# EAGLE design controller (EAGLE 8.7.1)

## Sheet 1 of 4
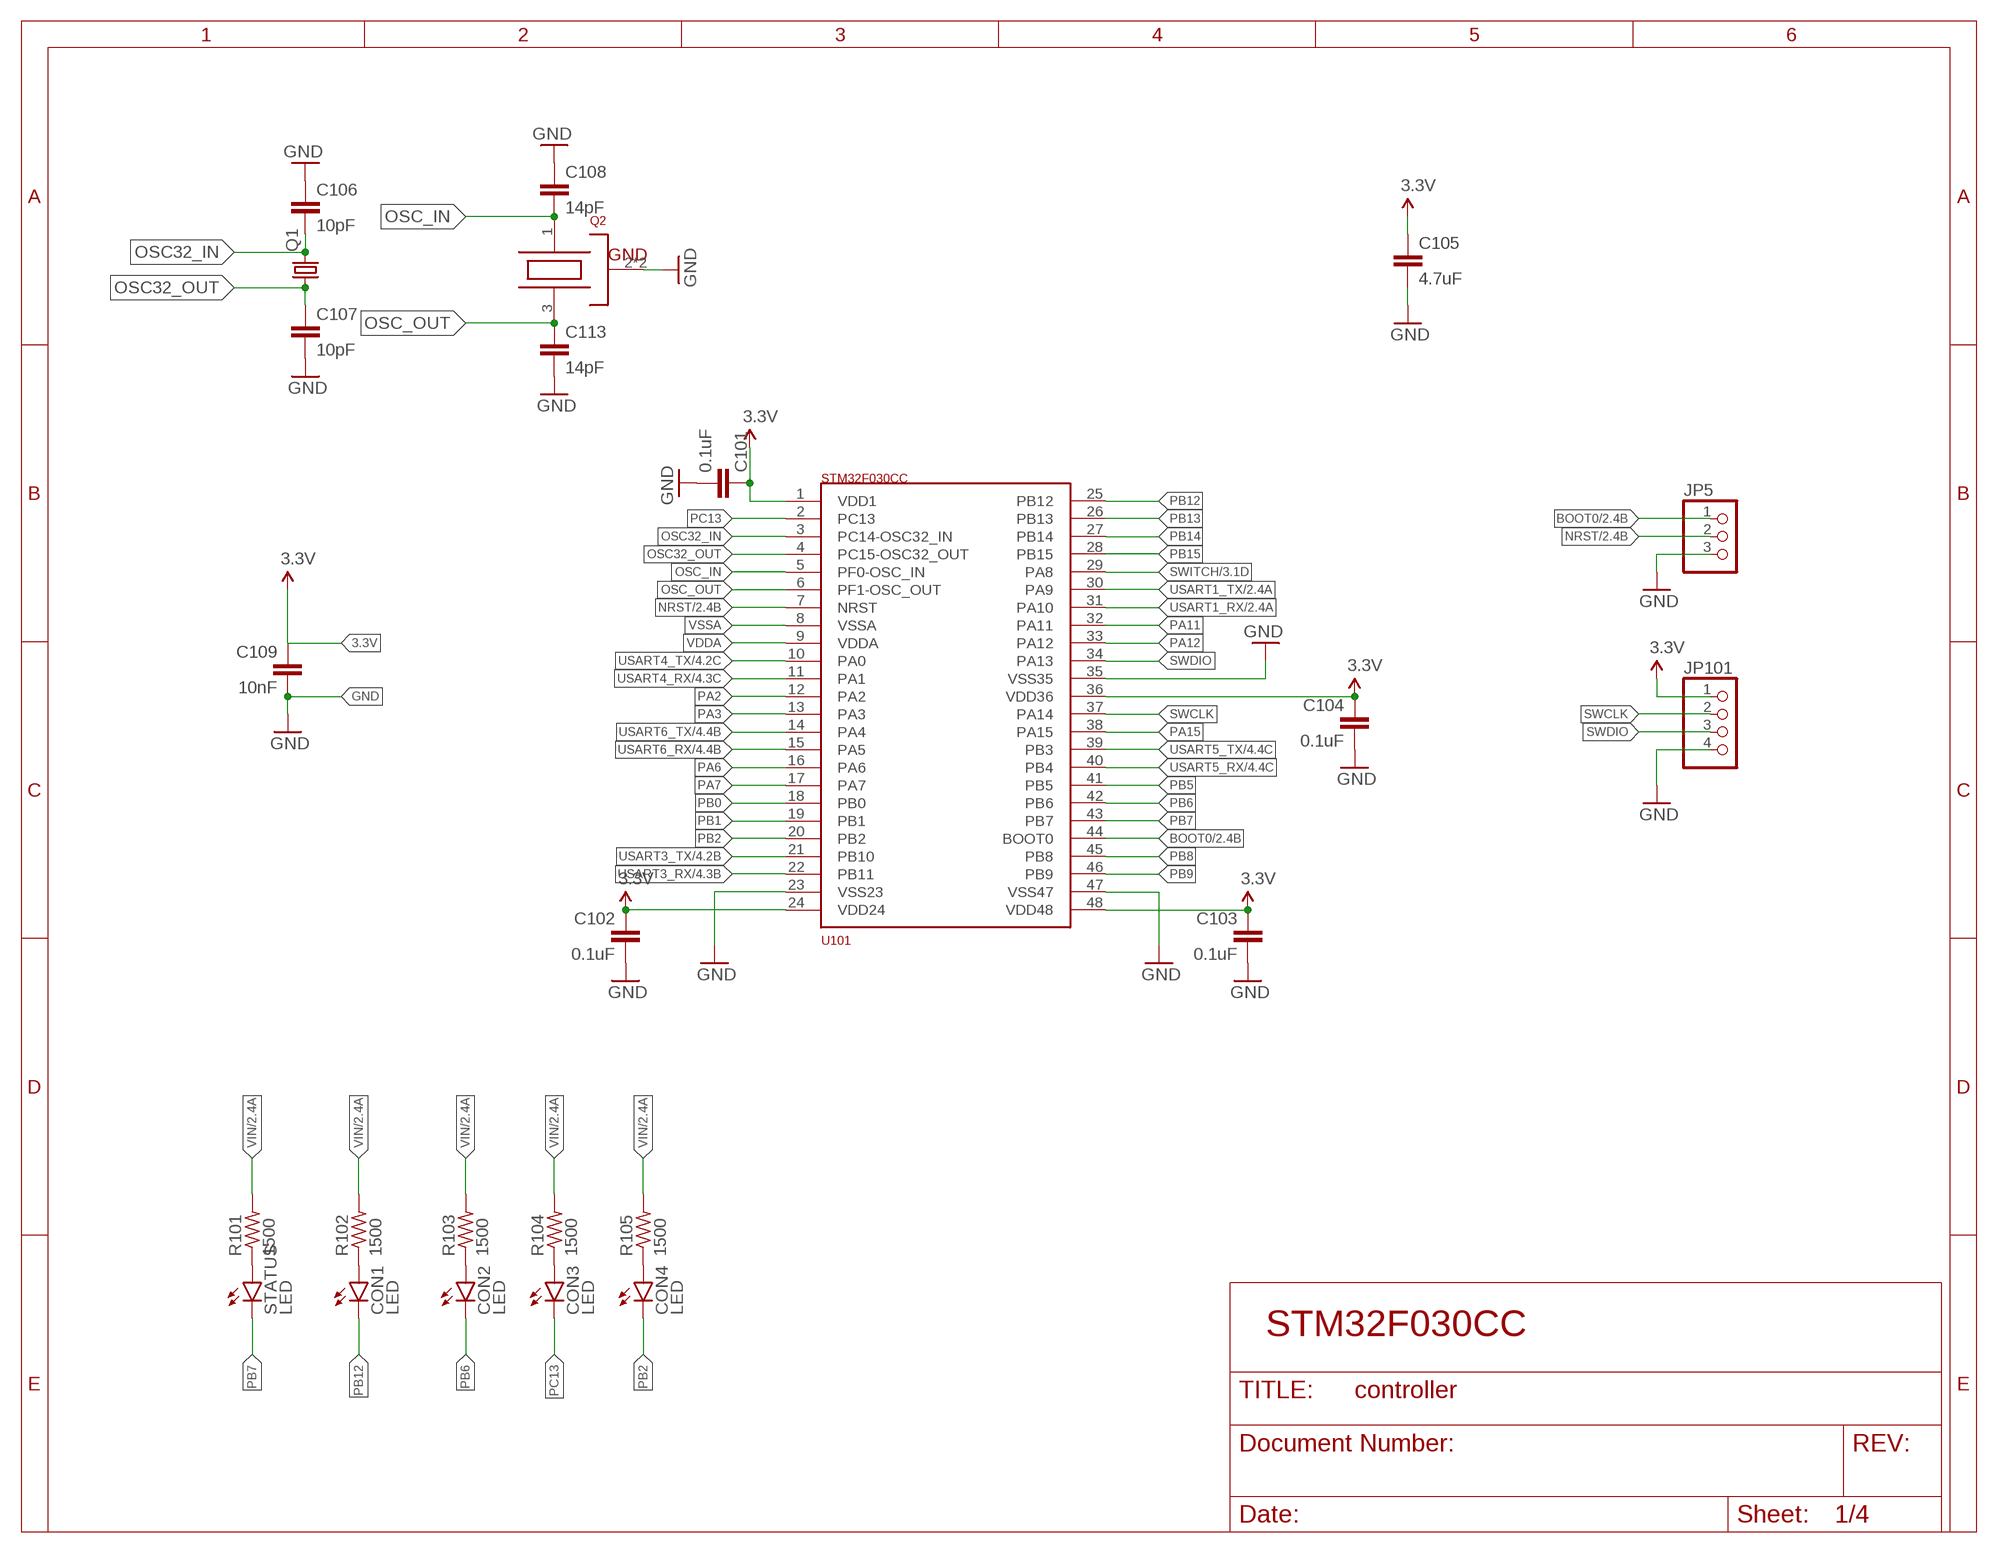
[diagram p0: schematic, sheet 1]

### Parts
C101  0.1uF  C0603  [0603-CAP]
C102  0.1uF  C0603  [0603-CAP]
C103  0.1uF  C0603  [0603-CAP]
C104  0.1uF  C0603  [0603-CAP]
C105  4.7uF  C0603  [0603-CAP]
C106  10pF  C0603  [0603-CAP]
C107  10pF  C0603  [0603-CAP]
C108  14pF  C0603  [0603-CAP]
C109  10nF  C0603  [0603-CAP]
C113  14pF  C0603  [0603-CAP]
CON1  LED  [LED-0603]
CON2  LED  [LED-0603]
CON3  LED  [LED-0603]
CON4  LED  [LED-0603]
JP5  PINHD-1X3  [1X03]
JP101  PINHD-1X4  [1X04]
Q1  CRYSTALFC1610AN  [FC1610AN]
Q2  OSCILLATOR  [OSC3.2X2.5]
R101  1500  R0603R0603  [R0603]
R102  1500  R0603R0603  [R0603]
R103  1500  R0603R0603  [R0603]
R104  1500  R0603R0603  [R0603]
R105  1500  R0603R0603  [R0603]
STATUS  LED  [LED-0603]
U101  STM32F030CC  [STM32F030CC]

### Nets
3.3V: C101.1 C102.1 C103.1 C104.1 C105.1 C109.1 JP101.1 U101.1(VDD1) U101.24(VDD24) U101.36(VDD36) U101.48(VDD48) ; also sheet 2,3
BOOT0: JP5.1 U101.44(BOOT0) ; also sheet 2
GND: C101.2 C102.2 C103.2 C104.2 C105.2 C106.1 C107.2 C108.1 C109.2 C113.2 JP5.3 JP101.4 Q2.2(GND) Q2.4(GND) U101.23(VSS23) U101.35(VSS35) U101.47(VSS47) ; also sheet 2,3,4
N$1: R101.1 STATUS.A
N$2: CON1.A R102.1
N$5: CON2.A R103.1
N$6: CON3.A R104.1
N$10: CON4.A R105.1
NRST: JP5.2 U101.7(NRST) ; also sheet 2
OSC32_IN: C106.2 Q1.2 U101.3(PC14-OSC32_IN)
OSC32_OUT: C107.1 Q1.1 U101.4(PC15-OSC32_OUT)
OSC_IN: C108.2 Q2.1(OSC1) U101.5(PF0-OSC_IN)
OSC_OUT: C113.1 Q2.3(OSC2) U101.6(PF1-OSC_OUT)
PA2: U101.12(PA2)
PA3: U101.13(PA3)
PA6: U101.16(PA6)
PA7: U101.17(PA7)
PA11: U101.32(PA11)
PA12: U101.33(PA12)
PA15: U101.38(PA15)
PB0: U101.18(PB0)
PB1: U101.19(PB1)
PB2: CON4.C U101.20(PB2)
PB5: U101.41(PB5)
PB6: CON2.C U101.42(PB6)
PB7: STATUS.C U101.43(PB7)
PB8: U101.45(PB8)
PB9: U101.46(PB9)
PB12: CON1.C U101.25(PB12)
PB13: U101.26(PB13)
PB14: U101.27(PB14)
PB15: U101.28(PB15)
PC13: CON3.C U101.2(PC13)
SWCLK: JP101.2 U101.37(PA14)
SWDIO: JP101.3 U101.34(PA13)
SWITCH: U101.29(PA8) ; also sheet 3
USART1_RX: U101.31(PA10) ; also sheet 2
USART1_TX: U101.30(PA9) ; also sheet 2
USART3_RX: U101.22(PB11) ; also sheet 4
USART3_TX: U101.21(PB10) ; also sheet 4
USART4_RX: U101.11(PA1) ; also sheet 4
USART4_TX: U101.10(PA0) ; also sheet 4
USART5_RX: U101.40(PB4) ; also sheet 4
USART5_TX: U101.39(PB3) ; also sheet 4
USART6_RX: U101.15(PA5) ; also sheet 4
USART6_TX: U101.14(PA4) ; also sheet 4
VDDA: U101.9(VDDA)
VIN: R101.2 R102.2 R103.2 R104.2 R105.2 ; also sheet 2,3,4
VSSA: U101.8(VSSA)

### Notes on the sheet
- STM32F030CC

## Sheet 2 of 4
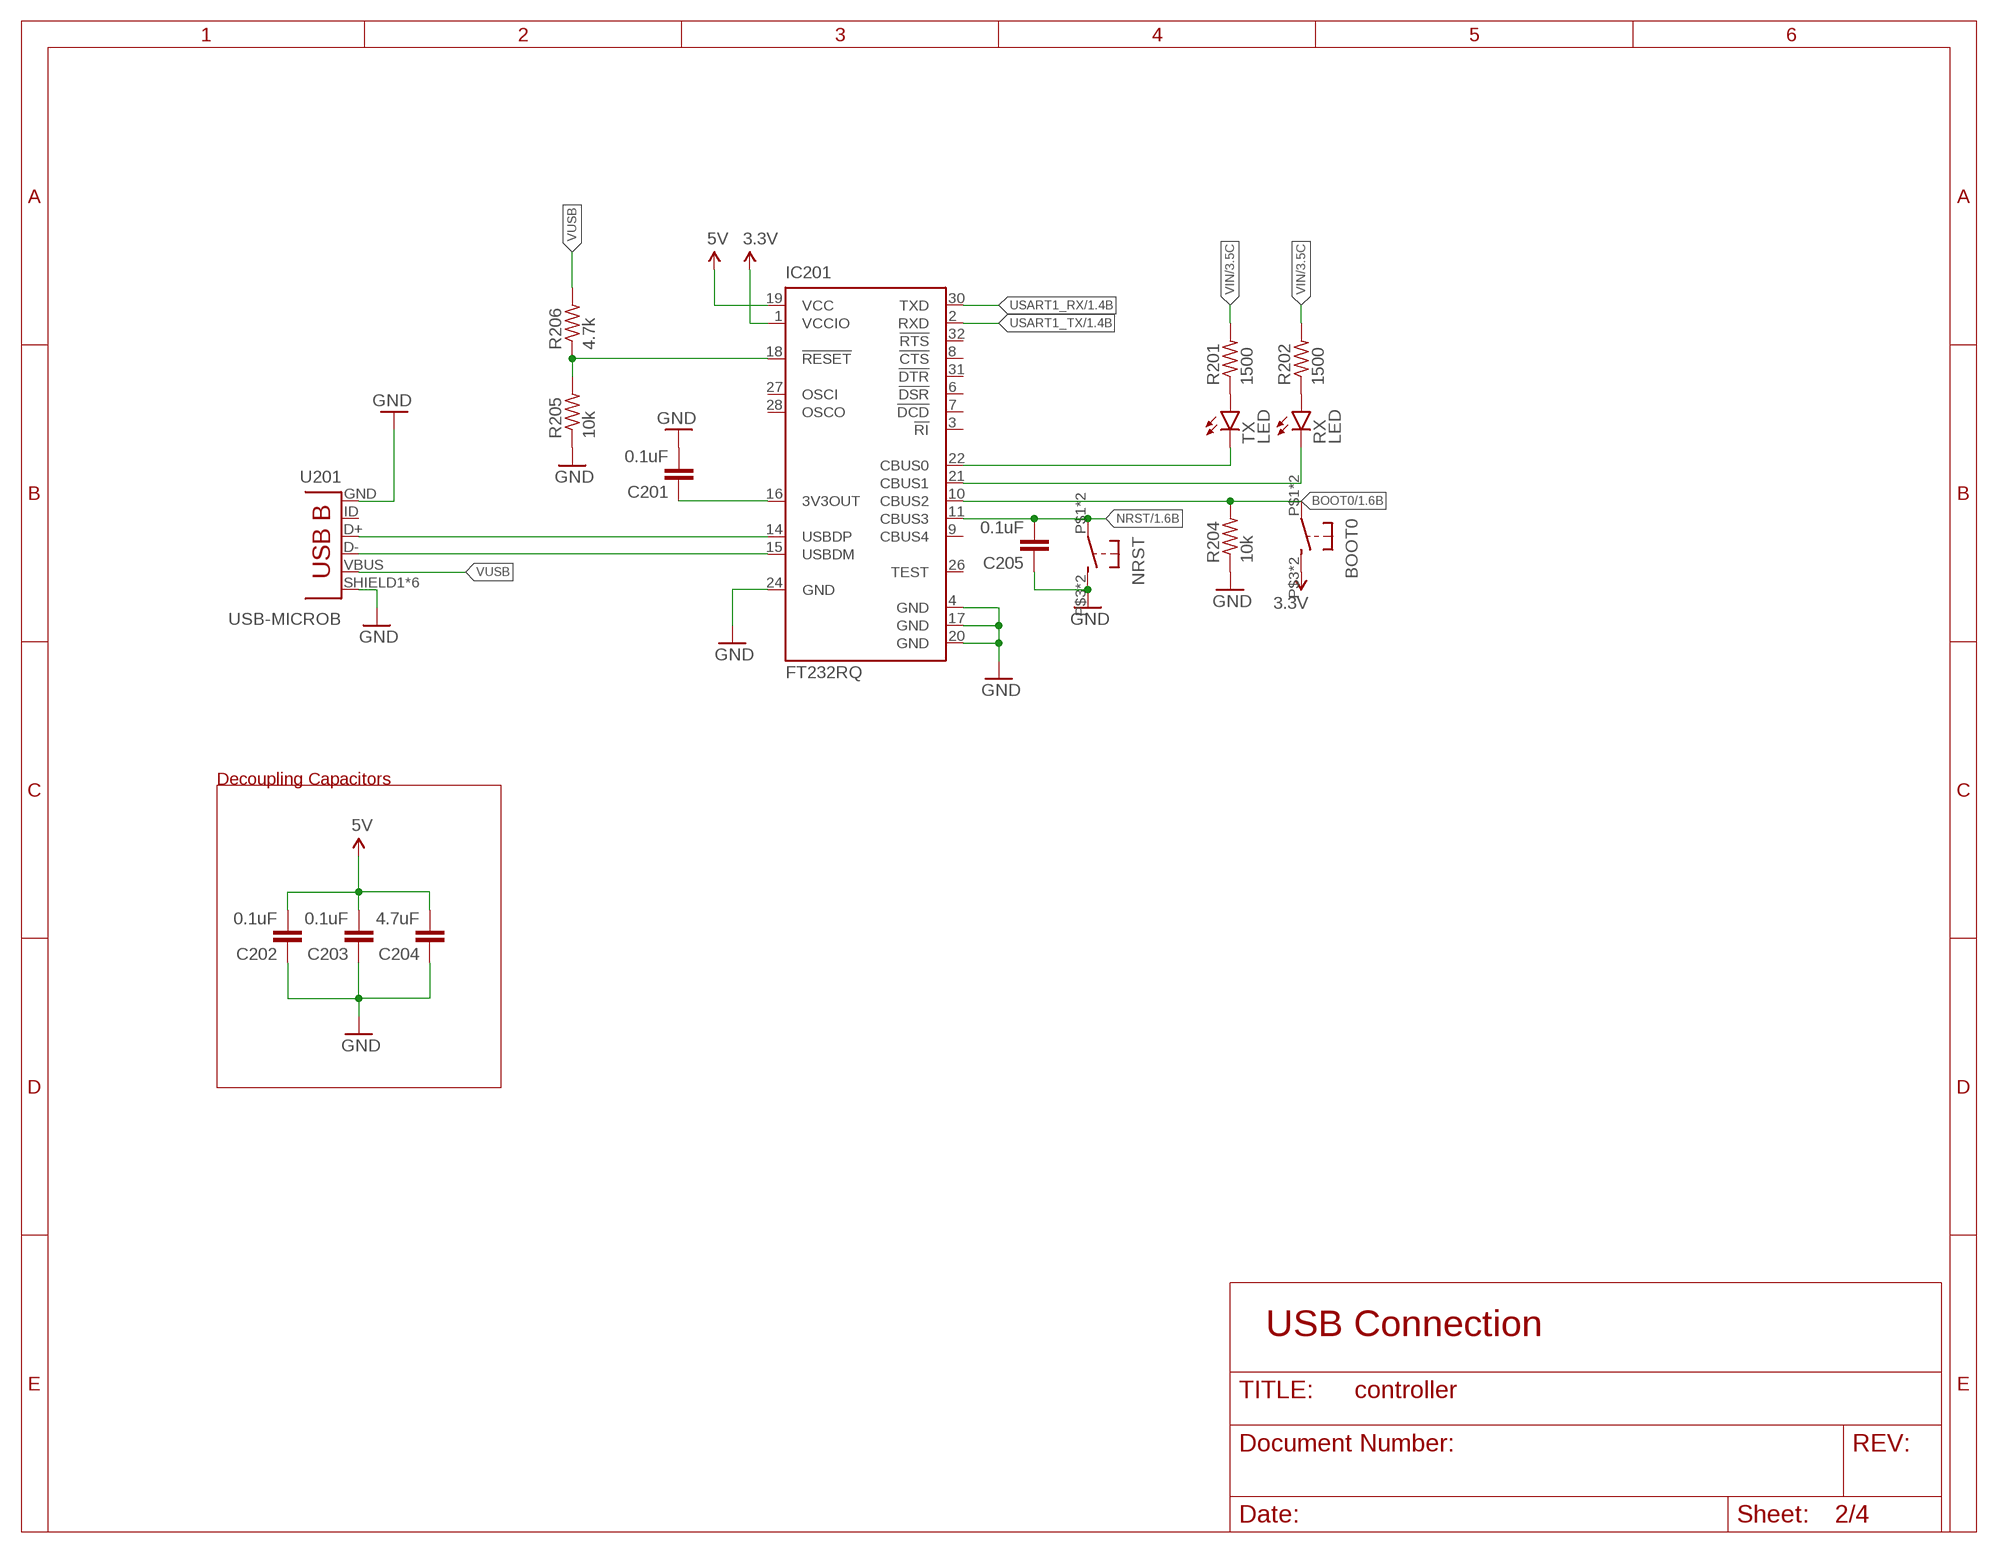
[diagram p1: schematic, sheet 2]

### Parts
BOOT0  BUTTON_MOMENTARY4P  [BUTTON_MOMENTARY_KMR211G]
C201  0.1uF  C0603  [0603-CAP]
C202  0.1uF  C0603  [0603-CAP]
C203  0.1uF  C0603  [0603-CAP]
C204  4.7uF  C0603  [0603-CAP]
C205  0.1uF  C0603  [0603-CAP]
IC201  FT232RQ  [QFN32]
NRST  BUTTON_MOMENTARY4P  [BUTTON_MOMENTARY_KMR211G]
R201  1500  R0603R0603  [R0603]
R202  1500  R0603R0603  [R0603]
R204  10k  R0603R0603  [R0603]
R205  10k  R0603R0603  [R0603]
R206  4.7k  R0603R0603  [R0603]
RX  LED  [LED-0603]
TX  LED  [LED-0603]
U201  USB-MICROB  [USB-B-MICRO-SMD]

### Nets
3.3V: BOOT0.P$3(S) BOOT0.P$4(S) IC201.1(VCCIO) ; also sheet 1,3
5V: C202.2 C203.2 C204.2 IC201.19(VCC) ; also sheet 3
BOOT0: BOOT0.P$1(P) BOOT0.P$2(P) IC201.10(CBUS2) R204.2 ; also sheet 1
GND: C201.2 C202.1 C203.1 C204.1 C205.1 IC201.4(GND) IC201.17(GND) IC201.20(GND) IC201.24(GND) NRST.P$3(S) NRST.P$4(S) R204.1 R205.1 U201.GND U201.SHIELD1(SHIELD) U201.SHIELD2(SHIELD) U201.SHIELD3(SHIELD) U201.SHIELD4(SHIELD) U201.SHIELD5(SHIELD) U201.SHIELD6(SHIELD) ; also sheet 1,3,4
N$3: IC201.18(!RESET) R205.2 R206.1
N$4: C201.1 IC201.16(3V3OUT)
N$7: R202.1 RX.A
N$8: R201.1 TX.A
NRST: C205.2 IC201.11(CBUS3) NRST.P$1(P) NRST.P$2(P) ; also sheet 1
RX_LED: IC201.21(CBUS1) RX.C
TX_LED: IC201.22(CBUS0) TX.C
USART1_RX: IC201.30(TXD) ; also sheet 1
USART1_TX: IC201.2(RXD) ; also sheet 1
USBDM: IC201.15(USBDM) U201.D-
USBDP: IC201.14(USBDP) U201.D+
VIN: R201.2 R202.2 ; also sheet 1,3,4
VUSB: R206.2 U201.VBUS
Unconnected: IC201.3(!RI) IC201.6(!DSR) IC201.7(!DCD) IC201.8(!CTS) IC201.9(CBUS4) IC201.26(TEST) IC201.27(OSCI) IC201.28(OSCO) IC201.31(!DTR) IC201.32(!RTS) U201.ID(USBID)

### Notes on the sheet
- Decoupling Capacitors
- USB Connection

## Sheet 3 of 4
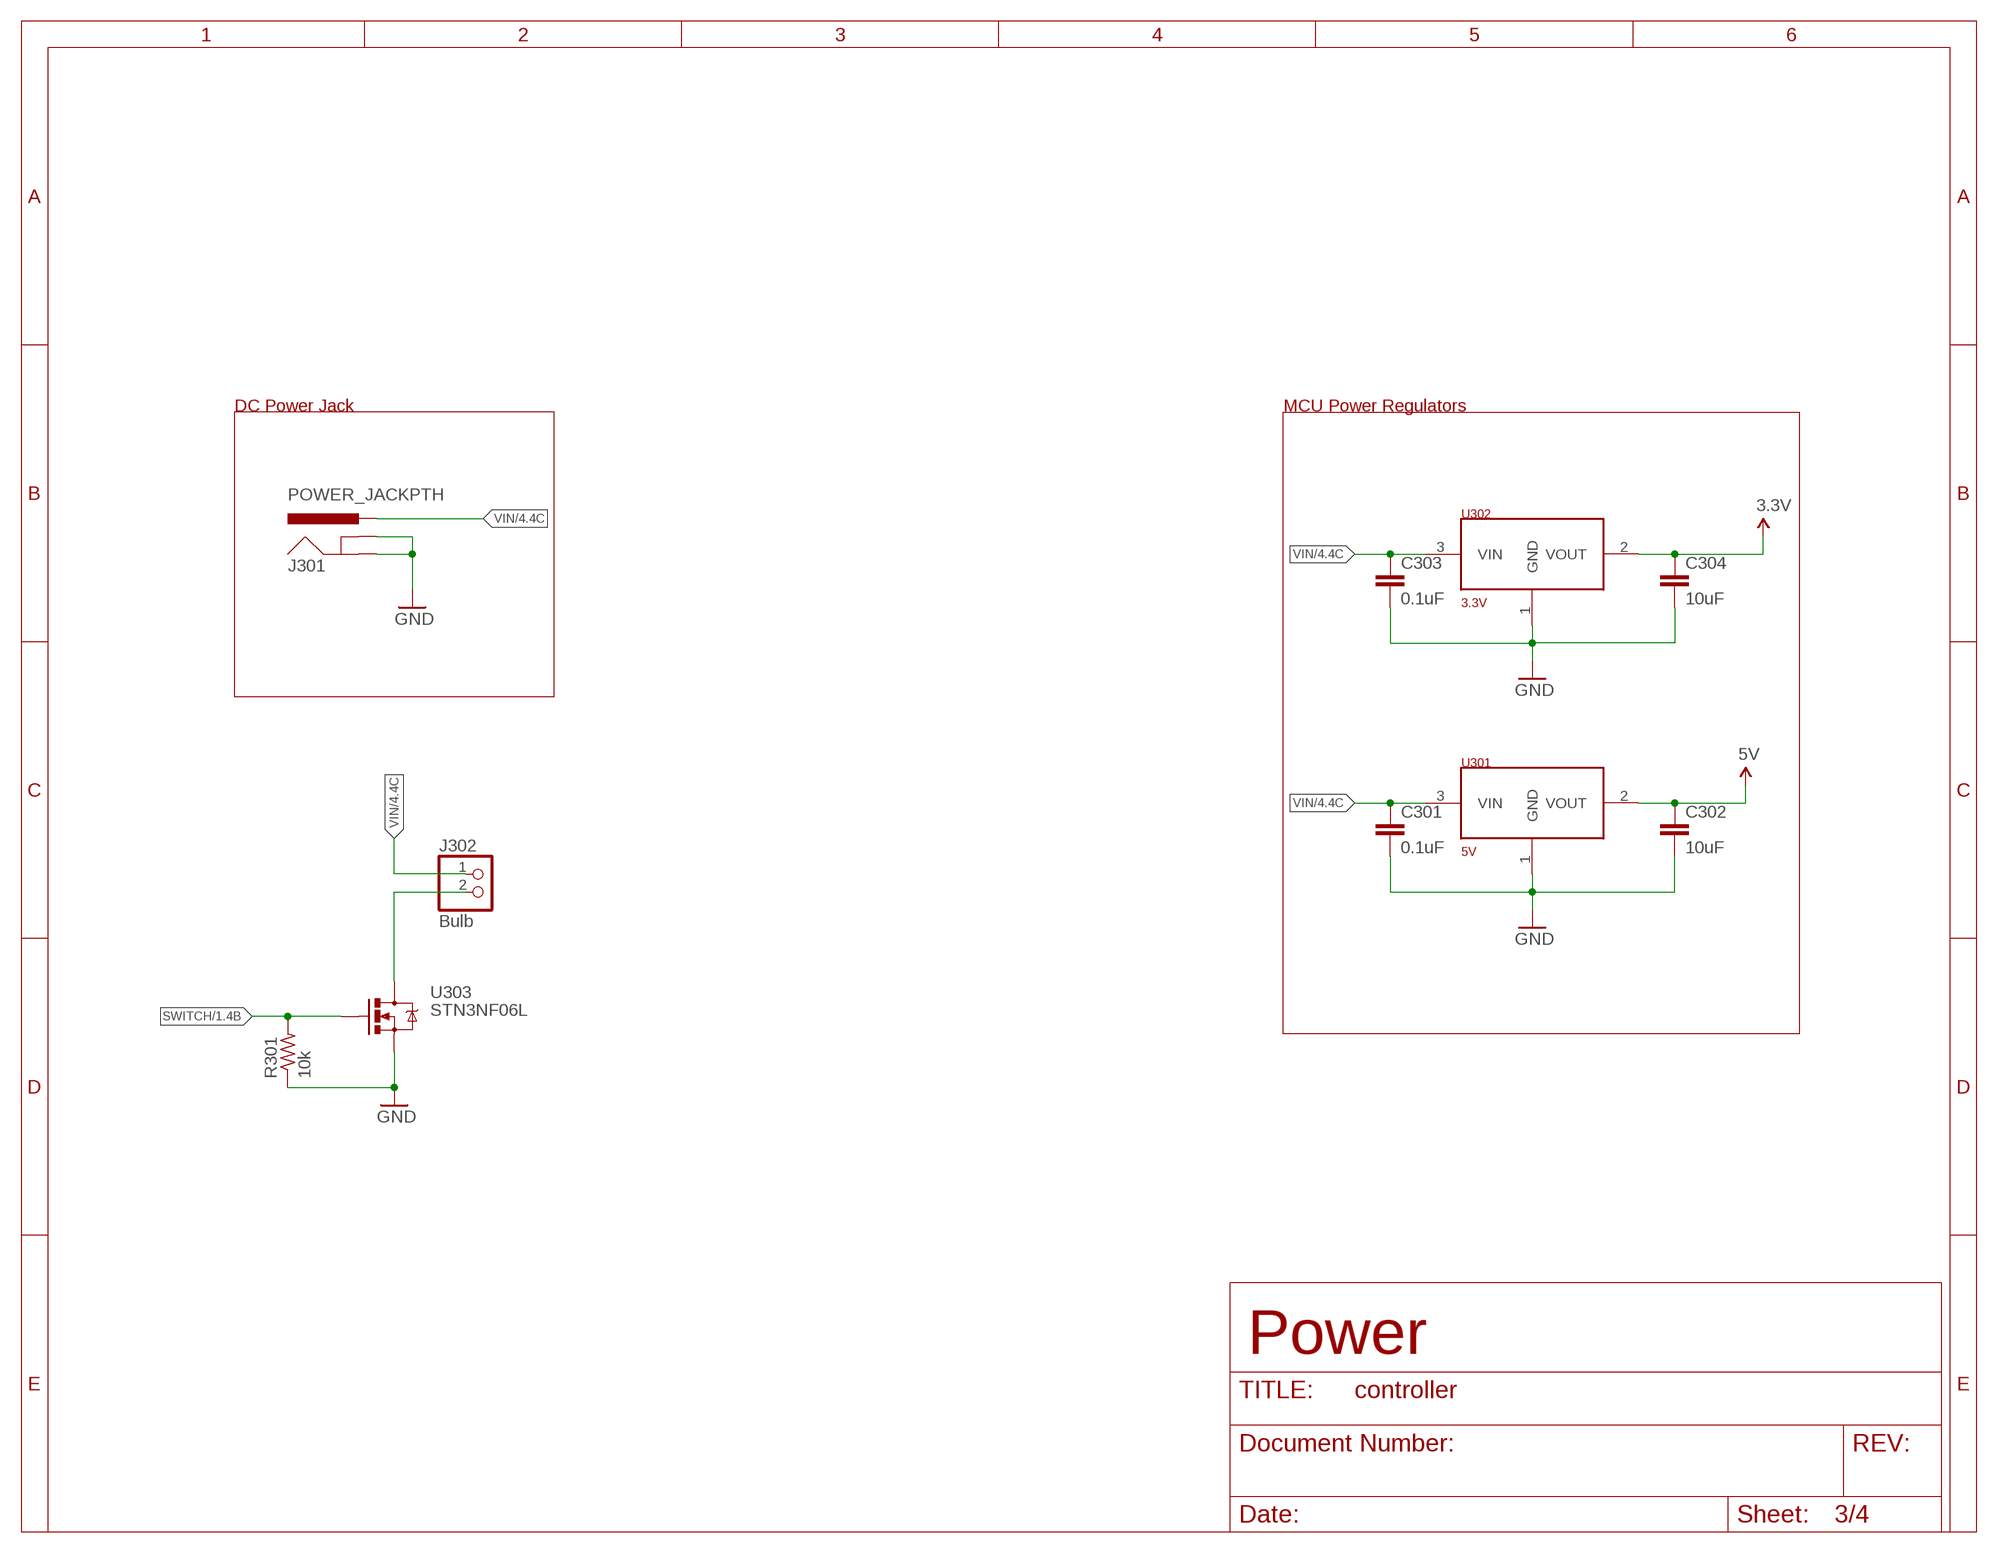
[diagram p2: schematic, sheet 3]

### Parts
C301  0.1uF  C0603  [0603-CAP]
C302  10uF  C0603  [0603-CAP]
C303  0.1uF  C0603  [0603-CAP]
C304  10uF  C0603  [0603-CAP]
J301  POWER_JACKPTH  [POWER_JACK_PTH]
J302  Bulb  PINHD-1X2  [1X02]
R301  10k  R0603R0603  [R0603]
U301  5V  LD1117  [SOT223]
U302  3.3V  LD1117  [SOT223]
U303  STN3NF06L  [SOT223]

### Nets
3.3V: C304.1 U302.2(VOUT) ; also sheet 1,2
5V: C302.1 U301.2(VOUT) ; also sheet 2
BULB: J302.2 U303.2(D) U303.4(D)
GND: C301.2 C302.2 C303.2 C304.2 J301.GND J301.GNDBREAK R301.1 U301.1(GND) U302.1(GND) U303.3(S) ; also sheet 1,2,4
SWITCH: R301.2 U303.1(G) ; also sheet 1
VIN: C301.1 C303.1 J301.PWR J302.1 U301.3(VIN) U302.3(VIN) ; also sheet 1,2,4

### Notes on the sheet
- DC Power Jack | MCU Power Regulators
- Power

## Sheet 4 of 4
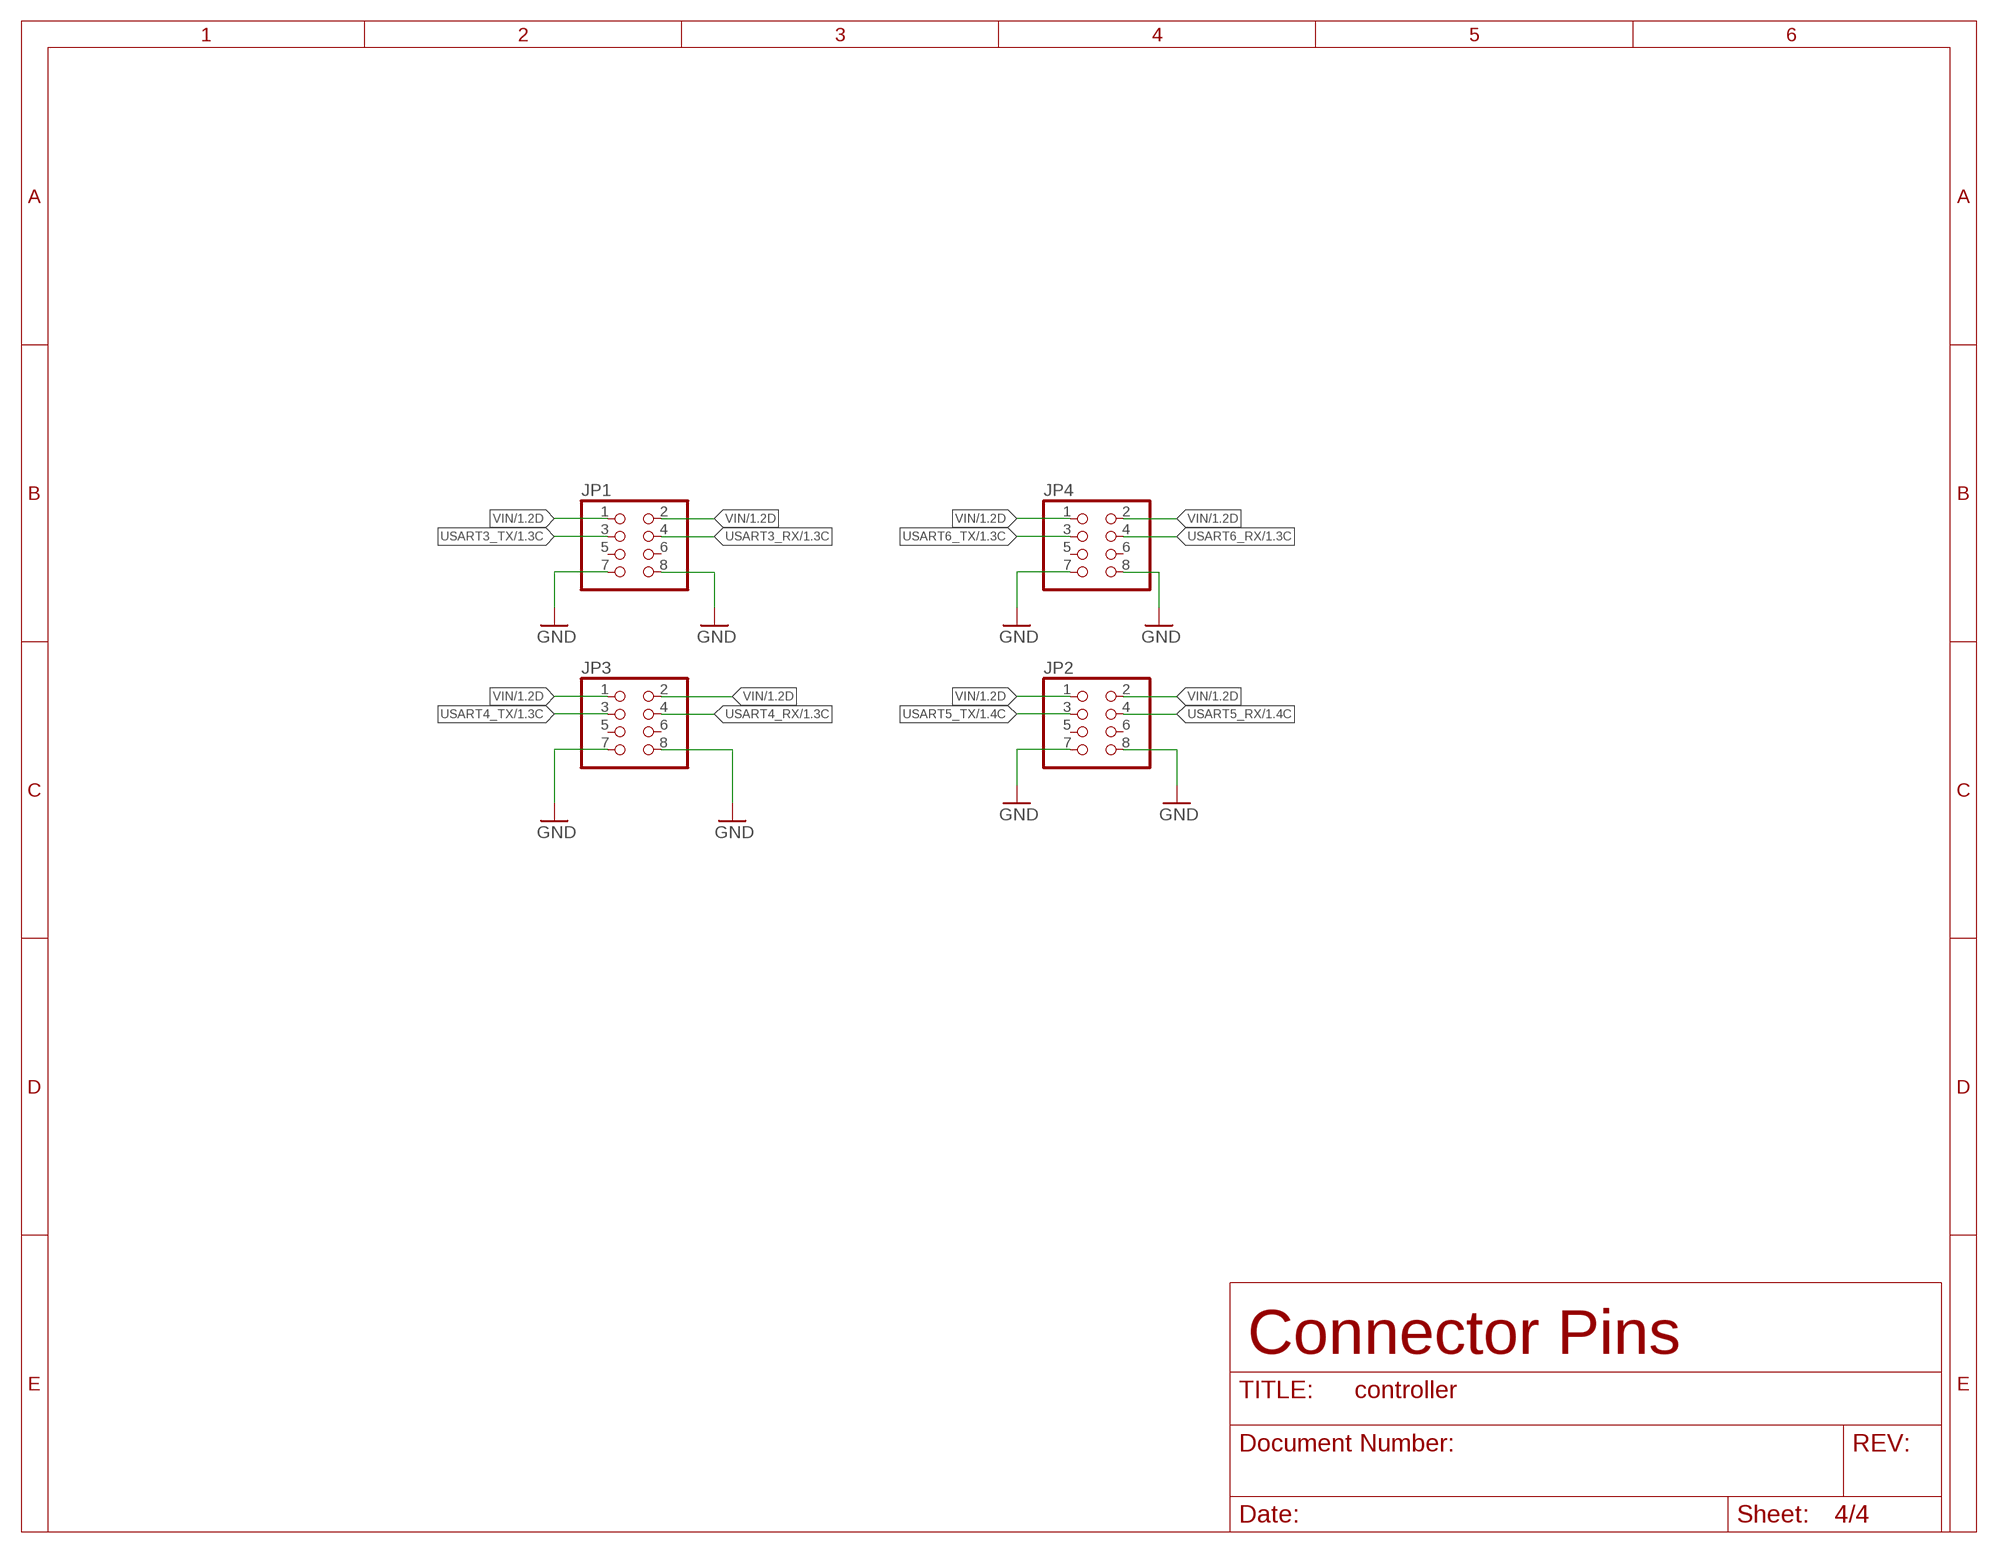
[diagram p3: schematic, sheet 4]

### Parts
JP1  PINHD-2X4  [2X04]
JP2  PINHD-2X4  [2X04]
JP3  PINHD-2X4  [2X04]
JP4  PINHD-2X4  [2X04]

### Nets
GND: JP1.7 JP1.8 JP2.7 JP2.8 JP3.7 JP3.8 JP4.7 JP4.8 ; also sheet 1,2,3
USART3_RX: JP1.4 ; also sheet 1
USART3_TX: JP1.3 ; also sheet 1
USART4_RX: JP3.4 ; also sheet 1
USART4_TX: JP3.3 ; also sheet 1
USART5_RX: JP2.4 ; also sheet 1
USART5_TX: JP2.3 ; also sheet 1
USART6_RX: JP4.4 ; also sheet 1
USART6_TX: JP4.3 ; also sheet 1
VIN: JP1.1 JP1.2 JP2.1 JP2.2 JP3.1 JP3.2 JP4.1 JP4.2 ; also sheet 1,2,3
Unconnected: JP1.5 JP1.6 JP2.5 JP2.6 JP3.5 JP3.6 JP4.5 JP4.6

### Notes on the sheet
- Connector Pins

## Library data of the parts
BOOT0 NRST = lights:BUTTON_MOMENTARY
C101-C109 C113 C201-C205 C301-C304 = lights:C0603: CAP-08604
CON1-CON4 RX STATUS TX = lights:LED
IC201 = lights:FT232R: Source: http://www.ftdichip.com/Documents/DataSheets/DS_FT232R_v104.pdf
J301 = lights:POWER_JACK: Power Jack This is the standard 5.5mm barrel jack for power. The PTH is the most common, proven, reliable, footprint. The Slot footprint only works if the mill layer is transmitted to the PCB fab house so be warned. Mating wall wart : TOL-00298 (and others)
J302 = lights:PINHD-1X2: PIN HEADER
JP1-JP4 = lights:PINHD-2X4: PIN HEADER
JP5 = lights:PINHD-1X3: PIN HEADER
JP101 = lights:PINHD-1X4: PIN HEADER
Q1 = lights:CRYSTAL: CRYSTAL
Q2 = lights:OSCILLATOR
R101-R105 R201 R202 R204-R206 R301 = lights:R0603: RESISTOR, American symbol
U101 = lights:STM32F030CC
U201 = lights:USB-MICROB
U301 U302 = lights:LD1117
U303 = lights:STN3NF06L

## Board
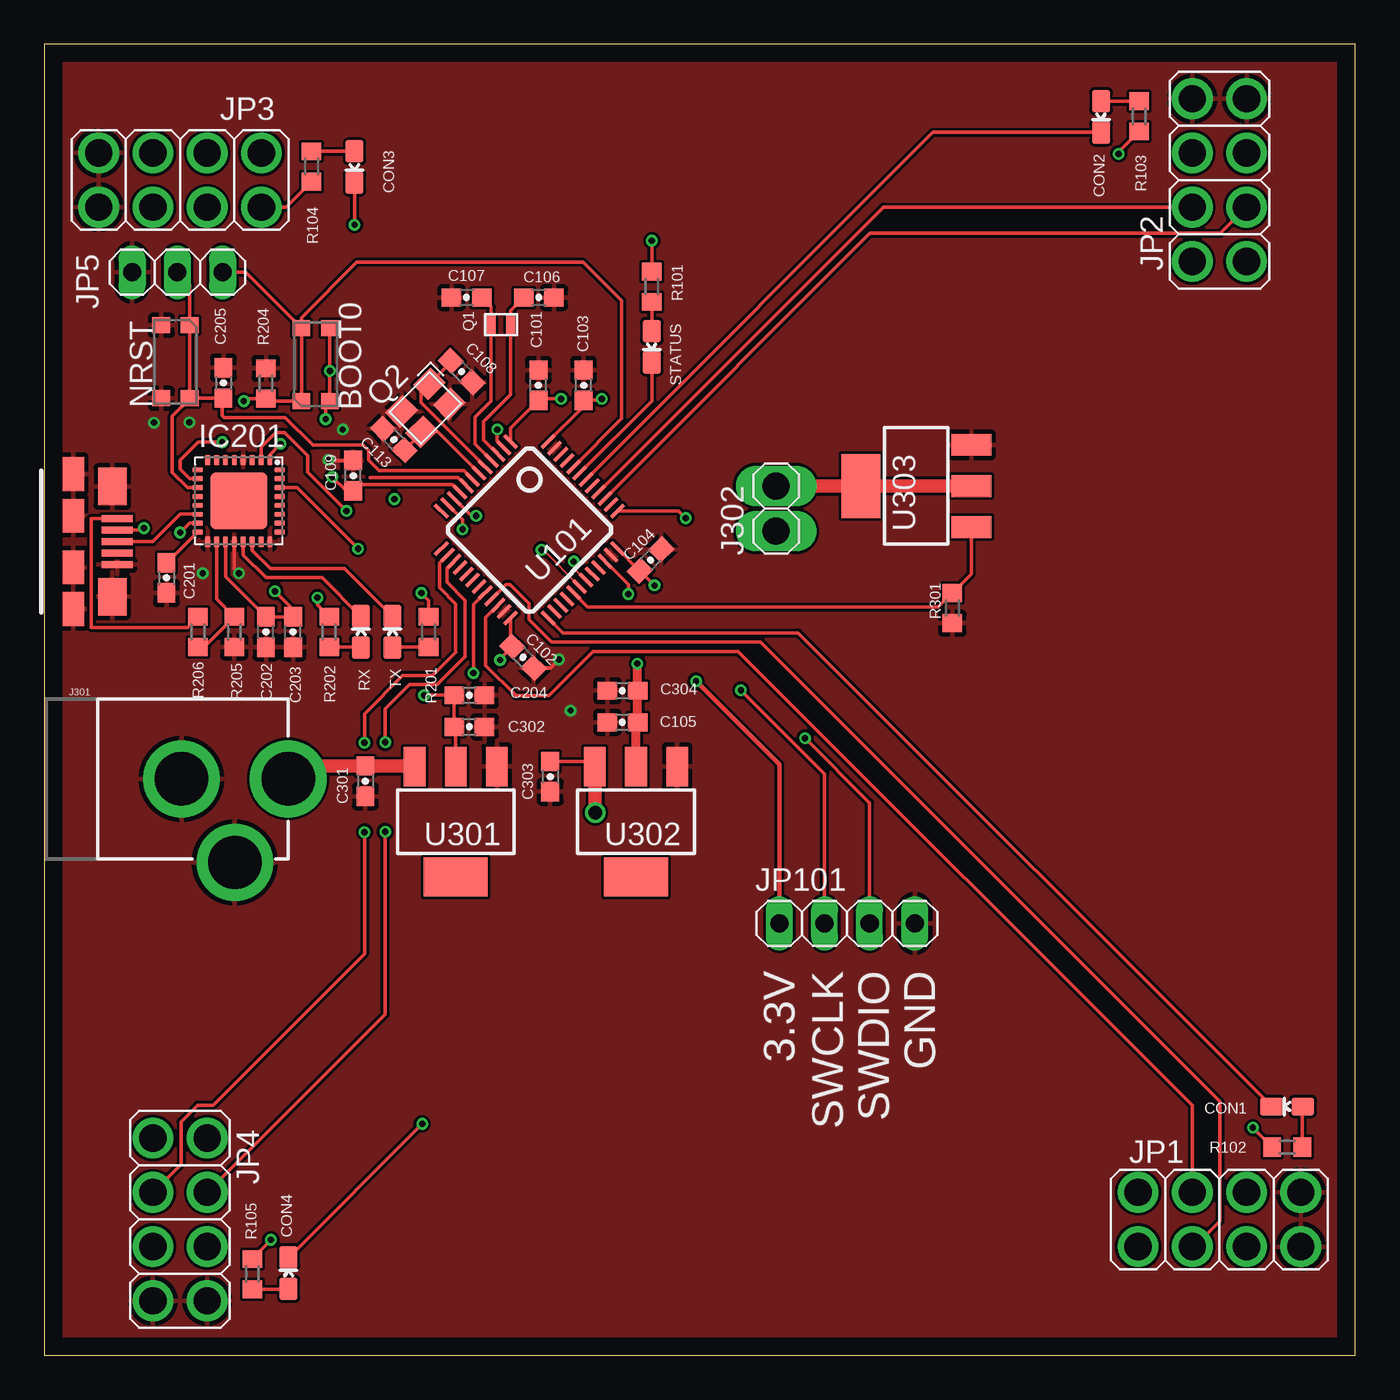
[diagram p4: board, top side]
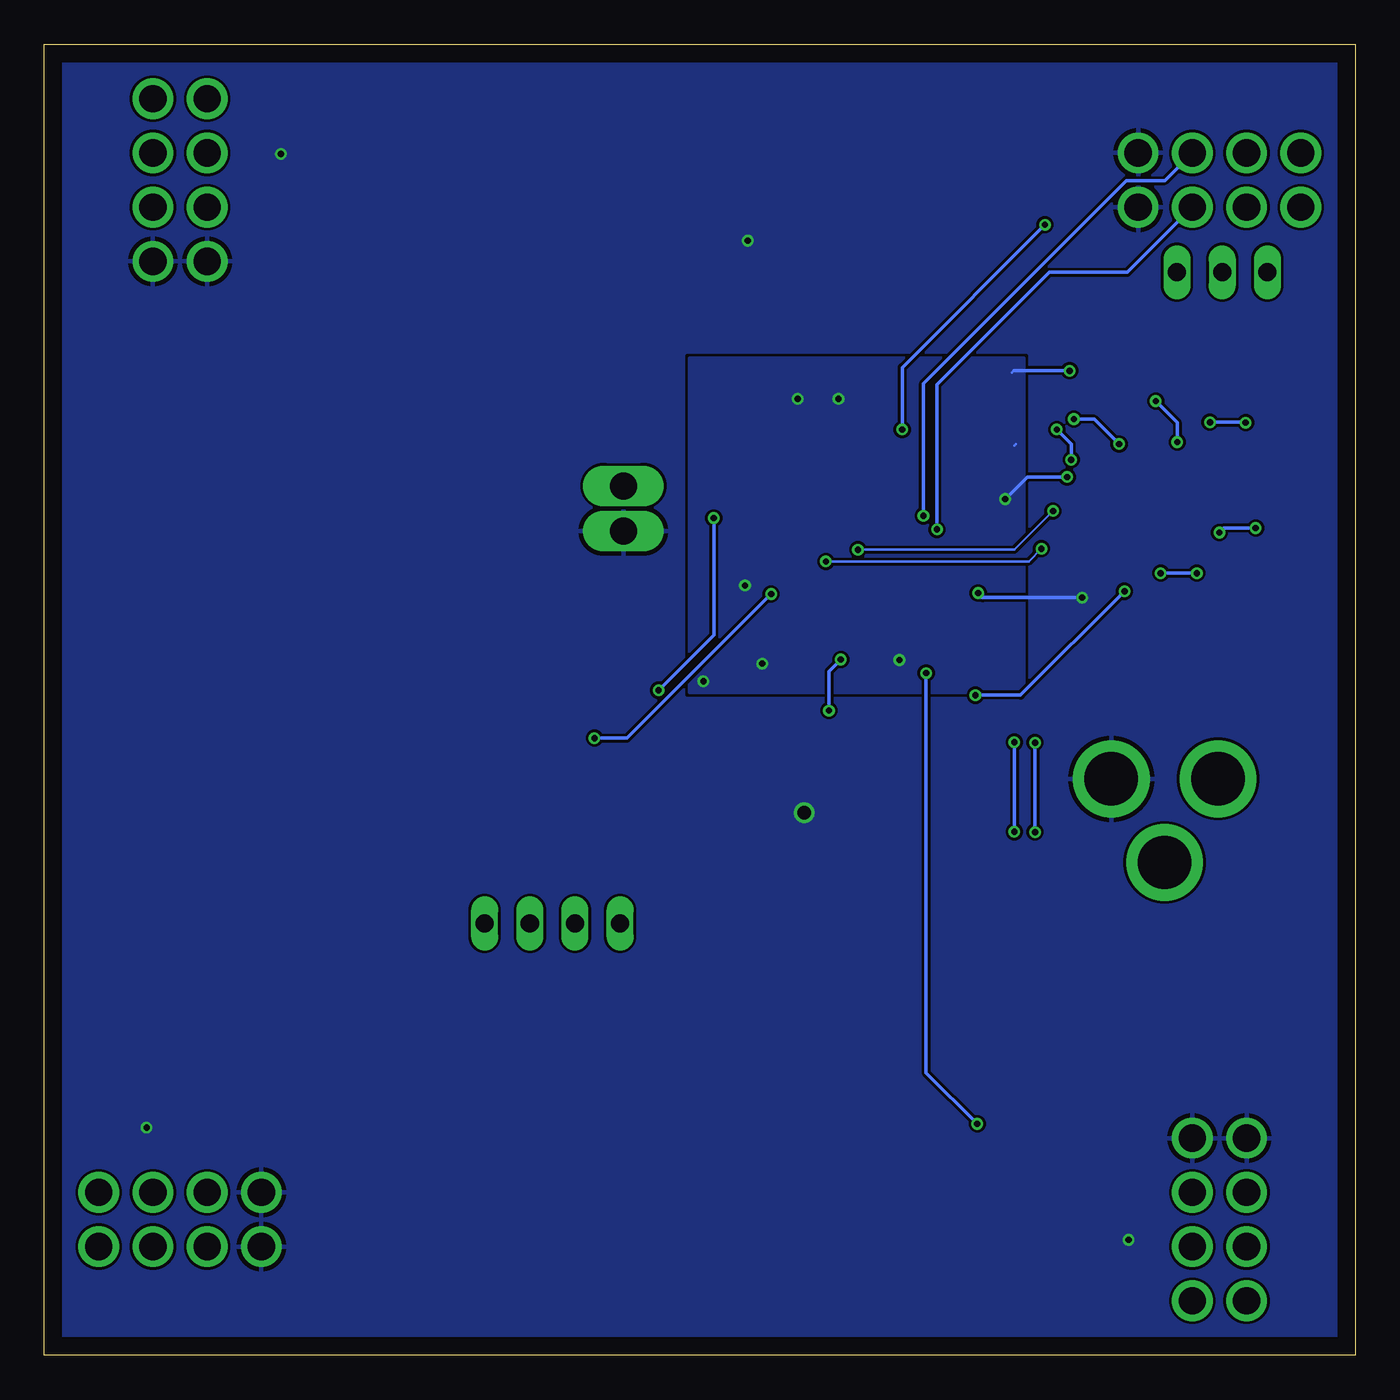
[diagram p5: board, bottom side, seen from below]

Size 73.66 x 73.66 mm. Coordinates in mm from the lower left corner, seen from the top.
Outline: 0,0 73.66,0 73.66,73.66 0,73.66 0,0
Copper layers (1*16): Top 0.035mm / dielectric 1.5mm / Bottom 0.035mm
Design rules "default *": minimum track width 6mil, minimum drill 8mil, track to track 6mil, track to pad 6mil, pad to pad 6mil, via to via 6mil, smd to smd 6mil, copper to edge 40mil, drill to drill 8mil, minimum pad ring 6mil, minimum via ring 6mil, stop-mask expansion 4mil, vias tented up to drill 0mil, thermal gap 10mil

### Footprints (pad centres in the part's own frame; a part is rotated, then mirrored left to right if it is on the bottom)
BUTTON_MOMENTARY_KMR211G = smd 0.9 x 1: P$1 -2,0.8; P$2 2.1,0.8; P$3 -2,-0.8; P$4 2.1,-0.8
0603-CAP = smd 1.092 x 1: 1 -0.85,0; 2 0.85,0
LED-0603 = smd 1.016 x 1.27: A 0,-0.877; C 0,0.877
QFN32 = smd 0.6 x 0.3: 1 -2.3,1.75; 2 -2.3,1.25; 3 -2.3,0.75; 4 -2.3,0.25; 5 -2.3,-0.25; 6 -2.3,-0.75; 7 -2.3,-1.25; 8 -2.3,-1.75; 17 2.3,-1.75; 18 2.3,-1.25; 19 2.3,-0.75; 20 2.3,-0.25; 21 2.3,0.25; 22 2.3,0.75; 23 2.3,1.25; 24 2.3,1.75 | smd 0.3 x 0.6: 9 -1.75,-2.3; 10 -1.25,-2.3; 11 -0.75,-2.3; 12 -0.25,-2.3; 13 0.25,-2.3; 14 0.75,-2.3; 15 1.25,-2.3; 16 1.75,-2.3; 25 1.75,2.3; 26 1.25,2.3; 27 0.75,2.3; 28 0.25,2.3; 29 -0.25,2.3; 30 -0.75,2.3; 31 -1.25,2.3; 32 -1.75,2.3 | smd 3.2 x 3.2: EXP 0,0
POWER_JACK_PTH = drill 2.997 pad 4.318: GND 0,7.7; GNDBREAK 4.7,10.7; PWR 0,13.7
1X02 = drill 1.524 long: 1 -1.27,0; 2 1.27,0
2X04 = drill 1.524: 1 -4.572,-1.524; 2 -4.572,1.524; 3 -1.524,-1.524; 4 -1.524,1.524; 5 1.524,-1.524; 6 1.524,1.524; 7 4.572,-1.524; 8 4.572,1.524
1X03 = drill 1.016 long: 1 -2.54,0; 2 0,0; 3 2.54,0
1X04 = drill 1.016 long: 1 -3.81,0; 2 -1.27,0; 3 1.27,0; 4 3.81,0
FC1610AN = smd 0.5 x 1: 1 -0.55,0; 2 0.55,0
OSC3.2X2.5 = smd 1.4 x 1.2: 1 -1.1,-0.8; 2 1.1,-0.8; 3 1.1,0.8; 4 -1.1,0.8
R0603 = smd 1 x 1.1: 1 -0.85,0; 2 0.85,0
STM32F030CC = smd 0.2 x 1: 1 -2.75,-4.25; 2 -2.25,-4.25; 3 -1.75,-4.25; 4 -1.25,-4.25; 5 -0.75,-4.25; 6 -0.25,-4.25; 7 0.25,-4.25; 8 0.75,-4.25; 9 1.25,-4.25; 10 1.75,-4.25; 11 2.25,-4.25; 12 2.75,-4.25; 25 2.75,4.25; 26 2.25,4.25; 27 1.75,4.25; 28 1.25,4.25; 29 0.75,4.25; 30 0.25,4.25; 31 -0.25,4.25; 32 -0.75,4.25; 33 -1.25,4.25; 34 -1.75,4.25; 35 -2.25,4.25; 36 -2.75,4.25 | smd 1 x 0.2: 13 4.25,-2.75; 14 4.25,-2.25; 15 4.25,-1.75; 16 4.25,-1.25; 17 4.25,-0.75; 18 4.25,-0.25; 19 4.25,0.25; 20 4.25,0.75; 21 4.25,1.25; 22 4.25,1.75; 23 4.25,2.25; 24 4.25,2.75; 37 -4.25,2.75; 38 -4.25,2.25; 39 -4.25,1.75; 40 -4.25,1.25; 41 -4.25,0.75; 42 -4.25,0.25; 43 -4.25,-0.25; 44 -4.25,-0.75; 45 -4.25,-1.25; 46 -4.25,-1.75; 47 -4.25,-2.25; 48 -4.25,-2.75
USB-B-MICRO-SMD = smd 0.4 x 1.75: D+ 0,2.825; D- -0.65,2.825; GND 1.3,2.825; ID 0.65,2.825; VBUS -1.3,2.825 | smd 2.1 x 1.6: SHIELD1 3.1,2.55; SHIELD2 -3.1,2.55 | smd 1.9 x 1.2: SHIELD3 -3.8,0.35; SHIELD4 -1.45,0.35; SHIELD5 1.45,0.35; SHIELD6 3.8,0.35
SOT223 = smd 1.219 x 2.235: 1 -2.311,-3.099; 2 0,-3.099; 3 2.311,-3.099 | smd 3.6 x 2.2: 4 0,3.099

### Placement (x,y rotation side)
BOOT0  15.24,55.63 90 top
C101  27.76,54.51 90 top
C102  26.9,39.22 315 top
C103  30.3,54.51 90 top
C104  34.06,44.68 45 top
C105  32.49,35.56 180 top
C106  27.79,59.44 180 top
C107  23.72,59.44 180 top
C108  23.44,55.27 135 top
C109  17.35,49.43 90 top
C113  19.63,51.46 135 top
C201  6.86,43.69 270 top
C202  12.45,40.64 90 top
C203  13.97,40.64 90 top
C204  23.88,37.08 180 top
C205  10.06,54.64 270 top
C301  18.03,32.26 270 top
C302  23.88,35.31 0 top
C303  28.42,32.51 270 top
C304  32.49,37.34 180 top
CON1  69.85,13.97 90 top
CON2  59.39,69.6 180 top
CON3  17.42,66.78 180 top
CON4  13.72,4.6 0 top
IC201  10.92,48.01 270 top
J301  0,32.38 270 top
J302  41.12,47.57 90 top
JP1  66.04,7.62 0 top
JP2  66.04,66.04 90 top
JP3  7.62,66.04 180 top
JP4  7.62,7.62 270 top
JP5  7.47,60.86 180 top
JP101  45.11,24.26 0 top
NRST  7.37,55.88 270 top
Q1  25.65,57.91 0 top
Q2  21.41,53.24 225 top
R101  34.14,60.05 90 top
R102  69.85,11.68 180 top
R103  61.52,69.62 270 top
R104  15.01,66.8 270 top
R105  11.68,4.55 90 top
R201  21.59,40.64 90 top
R202  16,40.64 90 top
R204  12.45,54.61 270 top
R205  10.67,40.64 90 top
R206  8.64,40.64 90 top
R301  51.03,41.99 90 top
RX  17.78,40.64 0 top
STATUS  34.14,56.67 180 top
TX  19.56,40.64 0 top
U101  27.25,46.38 225 top
U201  1.27,45.72 270 top
U301  23.11,29.97 180 top
U302  33.25,29.97 180 top
U303  49,48.84 90 top

### Tracks (layer width: path | path; a pad name or v marks a point on that pad's centre or on a via)
3.3V  (via drill 0.35)
  Top 0.152: 33.45,44.08 C104.1
  Top 0.203: BOOT0.P$4 v16.04,55.32 BOOT0.P$3 | U101.1 26.19,52.09 C101.1 27.85,53.75 v29.03,53.75 | U101.48 30.3,53.32 C103.1 31.23,53.66 v31.32,53.75 | U101.36 33.45,44.08 | C104.1 v34.28,43.26 v34.29,43.26 | IC201.1 12.67,50.62 v13.26,51.21 | U101.24 26.19,39.92 C102.1 25.6,39.12 v25.6,39.06 | 15.7,53.28 BOOT0.P$3 | v15.8,52.6 15.8,53.38 BOOT0.P$3 | C109.1 16.95,48.58 v16.18,49.35
  Top 0.254: JP101.1 41.3,33.2 v36.63,37.87
  Top 0.508: U302.2 33.25,35.47 C105.1 C304.1 33.34,38.85 v33.33,38.86
  Bottom 0.152: 19.05,51.21 19.15,51.1 | 19.18,55.32 19.28,55.22
  Bottom 0.203: v16.04,55.32 19.18,55.32 | v13.26,51.21 14.66,52.6 v15.8,52.6 | v16.18,49.35 18.41,49.35 v19.66,48.11
  pour Bottom: 37.41,37.24 18.62,37.24 18.62,56.03 37.41,56.03
5V  (via drill 0.35)
  Top 0.203: IC201.19 10.17,43.76 C202.2 C203.2 13.97,41.91 v12.95,42.93 | v21.34,37.08 C204.2 C302.1 23.11,35.22 U301.2
  Bottom 0.203: v21.34,37.08 18.8,37.08 v12.95,42.93
BOOT0  (via drill 0.35)
  Top 0.203: BOOT0.P$2 BOOT0.P$1 12.58,53.63 R204.2 11.34,53.76 v11.2,53.62 | IC201.10 8.15,49.26 7.62,49.78 7.62,50.29 8.64,51.31 v9.99,51.31 | BOOT0.P$2 14.44,58.31 17.55,61.42 30.28,61.42 32.44,59.26 32.44,52.62 U101.44 | JP5.1 11.31,60.86 BOOT0.P$2
  Bottom 0.203: v11.2,53.62 9.99,52.41 v9.99,51.31
BULB
  Top 0.762: U303.2 U303.4 J302.2
GND  (via drill 0.35)
  Top 0.203: IC201.20 10.67,44.19 v10.92,43.94 | C102.2 28.43,38.62 v28.91,39.09 | C109.2 15.99,50.28 v15.95,50.32
  Bottom 0.203: v10.92,43.94 v8.89,43.94 | v28.91,39.09 29.57,38.43 v29.57,36.22 | v8.15,52.43 6.17,52.43 v6.15,52.4 | v15.95,50.32 15.95,51.21 v16.76,52.02
  pour Top: 0,0 73.66,0 73.66,73.66 0,73.66
N$1
  Top 0.203: STATUS.A R101.1
N$2
  Top 0.203: R102.1 70.7,13.94 CON1.A
N$3
  Top 0.203: R206.1 8.97,39.79 R205.2 9.67,42.49 IC201.18
N$4
  Top 0.203: IC201.16 6.9,44.54 C201.1
N$5
  Top 0.203: CON2.A R103.1
N$6
  Top 0.203: R104.1 CON3.A
N$7
  Top 0.203: R202.1 17.75,39.79 RX.A
N$8
  Top 0.203: R201.1 19.59,39.79 TX.A
N$10
  Top 0.203: R105.1 13.69,3.7 CON4.A
NRST
  Top 0.203: NRST.P$2 8.17,57.76 NRST.P$1 8.17,60.16 JP5.2 | NRST.P$2 8.19,53.76 7.19,52.76 7.19,49.61 8.04,48.76 IC201.11 | NRST.P$2 9.98,53.78 | 9.98,53.78 C205.2 | U101.7 23.57,49.71 18.8,49.71 18.21,50.29 18.21,50.83 17.91,51.13 15.09,51.13 13.54,52.68 10.11,52.68 9.98,52.81 9.98,53.78
OSC32_IN
  Top 0.203: U101.3 24.69,51.42 24.69,52.48 26.2,53.99 Q1.2 26.2,58.7 C106.2
OSC32_OUT
  Top 0.203: U101.4 24.21,51.2 24.21,52.73 25.1,53.63 Q1.1 25.1,58.91 C107.1
OSC_IN
  Top 0.203: C108.2 22.84,55.8 Q2.1 21.16,54.12 21.16,53.54 U101.5
OSC_OUT
  Top 0.203: U101.6 22.09,51.9 Q2.3 21.2,51.82 C113.1
PB2  (via drill 0.35)
  Top 0.203: U101.20 24.11,42.17 v24.11,38.33 | CON4.C v21.23,12.99
  Bottom 0.203: v21.23,12.99 24.11,15.86 v24.11,38.33
PB6
  Top 0.203: U101.42 49.95,68.72 CON2.C
PB7
  Top 0.203: U101.43 34.14,53.62 STATUS.C
PB12
  Top 0.203: U101.25 29.16,40.59 42.35,40.59 CON1.C
PC13  (via drill 0.35)
  Top 0.203: U101.2 25.45,51.37 v25.45,52.02 | v17.42,63.52 CON3.C
  Bottom 0.203: v25.45,52.02 25.45,55.5 v17.42,63.52
RX_LED
  Top 0.203: RX.C 15.61,43.69 12.45,43.69 11.17,44.96 IC201.21
SWCLK  (via drill 0.35)
  Top 0.203: JP101.2 43.84,32.66 v39.14,37.36 | v36.04,47.04 35.64,47.44 U101.37
  Bottom 0.203: v39.14,37.36 36.04,40.46 v36.04,47.04
SWDIO  (via drill 0.35)
  Top 0.203: JP101.3 46.38,31.04 v42.75,34.67 | v32.82,42.77 32.82,43.29 U101.34
  Bottom 0.203: v42.75,34.67 40.92,34.67 v32.82,42.77
SWITCH
  Top 0.203: 51.08,42.89 R301.2 | U101.29 30.54,42.04 50.23,42.04 R301.2 | R301.2 52.1,43.9 U303.1
TX_LED
  Top 0.203: TX.C 16.88,44.2 12.7,44.2 11.67,45.22 IC201.22
USART1_RX  (via drill 0.35)
  Top 0.152: U101.31 29.74,44.24 v29.74,44.6
  Top 0.203: IC201.30 13.23,48.77 13.26,48.74 14.2,48.74 v17.62,45.32
  Bottom 0.152: v29.74,44.6 18.34,44.6 v17.62,45.32
USART1_TX  (via drill 0.35)
  Top 0.152: U101.30 28.02,45.26 v27.94,45.26
  Top 0.203: v16.97,47.44 14.78,49.63 14.78,50.55 13.49,51.84 12.98,51.84 12.17,51.03 IC201.2
  Bottom 0.152: v27.94,45.26 19.15,45.26 v16.97,47.44
USART3_RX
  Top 0.203: U101.22 24.79,41.44 24.79,38.76 26.49,37.06 28.35,37.06 30.84,39.55 38.99,39.55 64.52,14.02 JP1.4
USART3_TX
  Top 0.203: U101.21 25.95,43.31 26.16,43.31 27.23,42.24 27.23,41.35 28.5,40.08 40.23,40.08 66.06,14.25 66.06,7.52 64.64,6.1 JP1.3
USART4_RX  (via drill 0.35)
  Top 0.203: U101.11 23.5,46.96 v23.5,46.41
  Bottom 0.203: JP3.4 12.8,60.86 15.21,60.86 15.32,60.86 17.17,60.86 23.5,54.53 v23.5,46.41
USART4_TX  (via drill 0.35)
  Top 0.203: U101.10 23.99,47.17 v24.26,47.17
  Bottom 0.203: v24.26,47.17 24.26,54.61 12.85,66.02 10.69,66.02 JP3.3
USART5_RX
  Top 0.203: U101.40 47.16,64.52 JP2.4
USART5_TX
  Top 0.203: U101.39 46.39,63.04 66.09,63.04 JP2.3
USART6_RX  (via drill 0.35)
  Top 0.203: U101.15 22.63,44.23 22.63,43.43 23.65,42.42 23.65,39.27 22.07,37.69 20.52,37.69 19.15,36.32 v19.15,34.44 | v19.15,29.41 19.15,19.15 JP4.4
  Bottom 0.203: v19.15,34.44 v19.15,29.41
USART6_TX  (via drill 0.35)
  Top 0.203: U101.14 22.2,44.51 22.2,43.13 23.11,42.22 23.11,39.5 21.82,38.2 20.14,38.2 17.98,36.04 v17.98,34.42 | v17.98,29.39 17.98,22.55 9.47,14.05 8.61,14.05 7.67,13.11 7.67,10.72 JP4.3
  Bottom 0.203: v17.98,34.42 v17.98,29.39
USBDM  (via drill 0.35)
  Top 0.203: U201.D- 5.48,46.37 v5.59,46.48 | v7.62,46.23 8.15,46.76 IC201.15
  Bottom 0.203: v5.59,46.48 7.37,46.48 v7.62,46.23
USBDP
  Top 0.203: U201.D+ 6.1,45.72 7.63,47.26 IC201.14
VDDA
  Top 0.203: U101.9 22.95,48.92 17.69,48.92
VIN  (via drill 0.35, 0.76)
  Top 0.203: C303.1 30.9,33.36 U302.3 | R101.2 v34.14,62.64 | R202.2 15.34,42.15 v15.34,42.57 | v21.18,42.82 21.59,42.42 R201.2 | R102.2 67.92,12.76 v67.92,12.78 | R105.2 12.72,6.44 v12.72,6.48 | R103.2 60.38,67.63 v60.38,67.51 | JP3.2 13.57,64.52 R104.2
  Top 0.762: J301.PWR 14.42,33.11 C301.1 20.77,33.11 U301.3 | U302.3 30.94,30.5 v30.96,30.48
  Bottom 0.203: v15.34,42.57 20.93,42.57 v21.18,42.82
  pour Bottom (rank 6): 73.66,0 0,0 0,73.66 73.66,73.66
VSSA
  Top 0.203: U101.8 23.25,49.33 18.3,49.33
VUSB
  Top 0.203: 4.07,46.99 U201.VBUS 2.62,47.02 2.62,40.89 8.04,40.89 R206.2

### Text on the board
tNames: 3.3V | SWCLK | SWDIO | GND